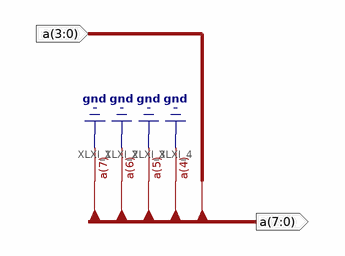
[diagram p0: schematic sheet 1]
// Xilinx ISE schematic extend_zero_4to8bit.sch (spartan3e) as structural Verilog: 0 symbols, 2 ports
module extend_zero_4to8bit (
  inout  [7:0] a
);


  assign a[7:4] = 4'b0000;
endmodule
